# EAGLE design Main (EAGLE 7.2.0)
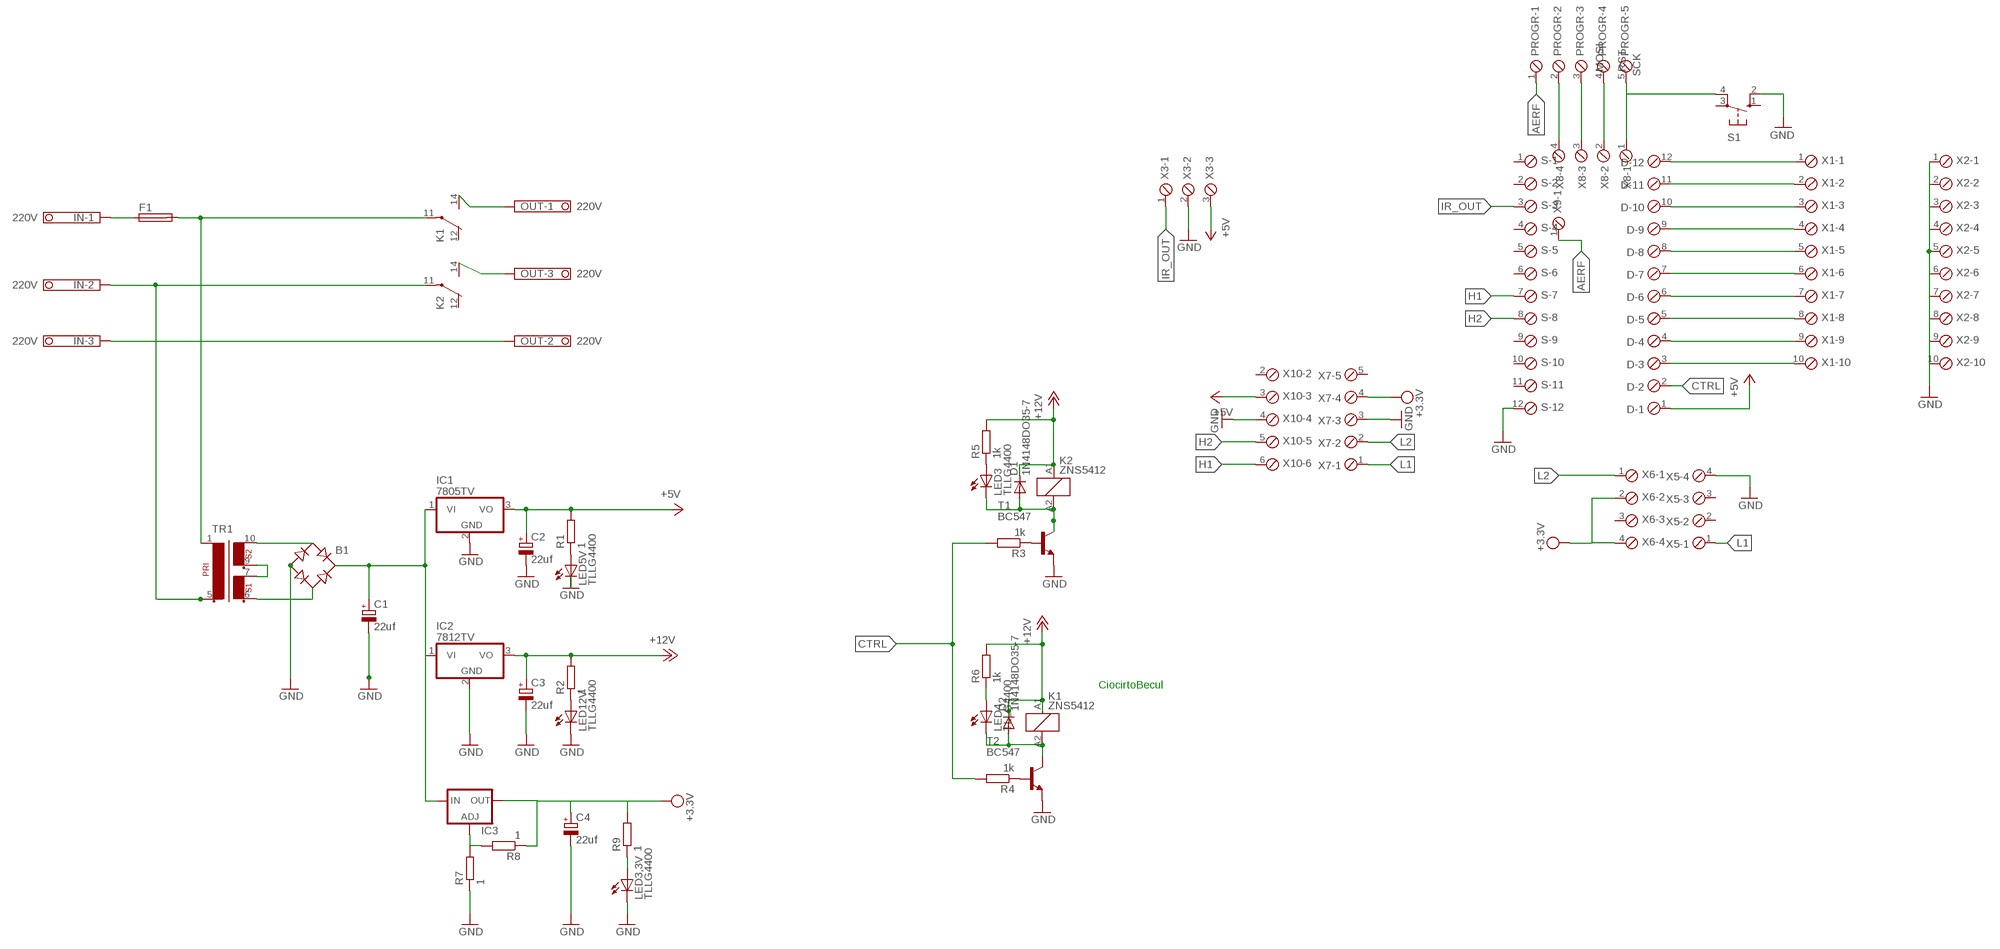
[diagram p0: schematic, sheet 1]

## Parts
B1  RB1A  [RB1A]
C1  22uf  CPOL-EUE2-4  [E2-4]
C2  22uf  CPOL-EUE2-4  [E2-4]
C3  22uf  CPOL-EUE2-4  [E2-4]
C4  22uf  CPOL-EUE2-4  [E2-4]
D  MPT12  [12POL254]
D1  1N4148DO35-7  [DO35-7]
D2  1N4148DO35-7  [DO35-7]
F1  SH25  [SH25]
IC1  7805TV  [TO220V]
IC2  7812TV  [TO220V]
IC3  LM317TS  [317TS]
IN  220V  1751251  [1751251]
K1  ZNS5412  [ZN5]
K2  ZNS5412  [ZN5]
LED3  TLLG4400  [LED3MM]
LED3,3V  TLLG4400  [LED3MM]
LED4  TLLG4400  [LED3MM]
LED5V  TLLG4400  [LED3MM]
LED12V  TLLG4400  [LED3MM]
OUT  220V  1751251  [1751251]
PROGR  SCK  MPT5  [5POL254]
R1  1  R-EU_0204/5  [0204/5]
R2  1  R-EU_0204/5  [0204/5]
R3  1k  R-EU_0204/5  [0204/5]
R4  1k  R-EU_0204/5  [0204/5]
R5  1k  R-EU_0204/5  [0204/5]
R6  1k  R-EU_0204/5  [0204/5]
R7  1  R-EU_0204/5  [0204/5]
R8  1  R-EU_0204/5  [0204/5]
R9  1  R-EU_0204/5  [0204/5]
S  MPT12  [12POL254]
S1  10-XX  [B3F-10XX]
T1  BC547  [TO92]
T2  BC547  [TO92]
TR1  EI30-2  [EI30-2]
X1  MPT10  [10POL254]
X2  MPT10  [10POL254]
X3  MPT3  [3POL254]
X5  MPT4  [4POL254]
X6  MPT4  [4POL254]
X7  MPT6  [6POL254]
X8  MPT4  [4POL254]
X9  MPT2  [2POL254]
X10  MPT6  [6POL254]

## Nets
+5V: C2.+ D.1 IC1.3(VO) R1.2 X3.3 X10.3
+12V: C3.+ D1.C D2.C IC2.3(VO) K1.A1 K2.A1 R2.2 R5.2 R6.2
AERF: PROGR.1 X9.1
CTRL: D.2 R3.2 R4.2
GND: B1.- C1.- C2.- C3.- C4.- IC1.2(GND) IC2.2(GND) LED3,3V.K(C) LED5V.K(C) LED12V.K(C) R7.1 S1.2(S1) S.12 T1.1(E) T2.1(E) X2.1 X2.2 X2.3 X2.4 X2.5 X2.6 X2.7 X2.8 X2.9 X2.10 X3.2 X5.4 X7.3 X10.4
H1: S.7 X10.6
H2: S.8 X10.5
IR_OUT: S.3 X3.1
L1: X5.1 X7.1
L2: X6.1 X7.2
N$1: F1.2 K1.11(2:P) TR1.1
N$2: IN.2 K2.11(2:P) TR1.5
N$3: F1.1 IN.1
N$4: K2.14(2:S) OUT.3
N$5: TR1.7 TR1.9
N$6: B1.AC1 TR1.10
N$7: B1.AC2 TR1.6
N$8: B1.+ C1.+ IC1.1(VI) IC2.1(VI) IC3.3(IN)
N$9: D1.A K2.A2 LED3.K(C) T1.3(C)
N$10: LED12V.A R2.1
N$11: LED3.A R5.1
N$12: D2.A K1.A2 LED4.K(C) T2.3(C)
N$13: LED5V.A R1.1
N$14: R3.1 T1.2(B)
N$15: R4.1 T2.2(B)
N$16: PROGR.2 X8.4
N$17: IN.3 OUT.2
N$18: LED4.A R6.1
N$19: IC3.1(ADJ) R7.2 R8.2
N$20: LED3,3V.A R9.1
N$23: PROGR.3 X8.3
N$24: PROGR.4 X8.2
N$25: PROGR.5 S1.4(P1) X8.1
N$27: K1.14(2:S) OUT.1
N$41: D.12 X1.1
N$42: D.11 X1.2
N$43: D.10 X1.3
N$44: D.9 X1.4
N$45: D.8 X1.5
N$46: D.7 X1.6
N$47: D.6 X1.7
N$48: D.5 X1.8
N$49: D.4 X1.9
N$50: D.3 X1.10
VCC: C4.+ IC3.2(OUT) R8.1 R9.2 X6.2 X6.4 X7.4 ; supply symbol labelled +3.3V
Unconnected: K1.12(2:O) K2.12(2:O) S1.1(S) S1.3(P) S.1 S.2 S.4 S.5 S.6 S.9 S.10 S.11 X5.2 X5.3 X6.3 X7.5 X7.6 X9.2 X10.1 X10.2

## Notes on the sheet
- CiocirtoBecul

## Library data of the parts
B1 = rectifier:RB1A: RECTIFIER 1 A
C1-C4 = rcl:CPOL-EU: POLARIZED CAPACITOR, European symbol
D S = con-phoenix-254:MPT12: PHOENIX CONNECTOR; OC_FARNELL: unknown; OC_NEWARK: unknown
D1 D2 = diode:1N4148: DIODE high speed (Philips)
F1 = fuse:SH25: FUSE HOLDER grid 25 mm, OGN0031 8211, Schurter (Buerklin); MF: SCHURTER; MPN: 0031.8211; OC_FARNELL: 1162741; OC_NEWARK: 96B9380
IC1 IC2 = linear:78*: Positive VOLTAGE REGULATOR Source: http://cache.national.com/ds/LM/LM78L05.pdf http://www.fairchildsemi.com/ds/LM/LM7805.pdf
IC3 = v-reg:LM317TS: VOLTAGE REGULATOR
IN OUT = con-phoenix-350:1751251: MKDS 1/ 3-3,5 Printklemme Nennstrom: 10 A Bemessungsspannung: 160 V Raster: 3,5 mm Polzahl: 3 Montageart: Löten Anschlussart: Schraubanschluss Anschlussrichtung vom Leiter zur Platine: 0° Source: http://eshop.phoenixcontact.com .. 1751251.pdf; OC_FARNELL: unknown; OC_NEWARK: unknown
K1 K2 = relay:ZNS5*: Miniature Power PCB Relay SCHRACK 1pole 10 A Source: http://www.schrack.com/.. 5847.pdf; OC_FARNELL: unknown; OC_NEWARK: unknown
LED3 LED3,3V LED4 LED5V LED12V = led:TLLG4400: Low Current (2mA) LED 3 mm Tinted Diffused Package color GREEN Source: Data sheet <http://www.farnell.com/datasheets/391098.pdf>; MF: VISHAY SEMICONDUCTOR; OC_FARNELL: 1612435
PROGR = con-phoenix-254:MPT5: PHOENIX CONNECTOR; KIND: RST; KIND2: MOSI; OC_FARNELL: unknown; OC_NEWARK: unknown
R1-R9 = rcl:R-EU_: RESISTOR, European symbol
S1 = switch-omron:10-XX: OMRON SWITCH; MPN: B3F-1000; OC_FARNELL: 176432; OC_NEWARK: 36M3542
T1 T2 = transistor:BC547: NPN TRANSISTOR
TR1 = trafo:EI30-2: TRANSFORMER 1 primary winding, 2 secondary windings ERA
X1 X2 = con-phoenix-254:MPT10: PHOENIX CONNECTOR; OC_FARNELL: unknown; OC_NEWARK: unknown
X3 = con-phoenix-254:MPT3: PHOENIX CONNECTOR; OC_FARNELL: unknown; OC_NEWARK: unknown
X5 X6 X8 = con-phoenix-254:MPT4: PHOENIX CONNECTOR; OC_FARNELL: unknown; OC_NEWARK: unknown
X7 X10 = con-phoenix-254:MPT6: PHOENIX CONNECTOR; OC_FARNELL: unknown; OC_NEWARK: unknown
X9 = con-phoenix-254:MPT2: PHOENIX CONNECTOR; OC_FARNELL: unknown; OC_NEWARK: unknown

## Net classes
0 default: width 0.61 mm

## Board
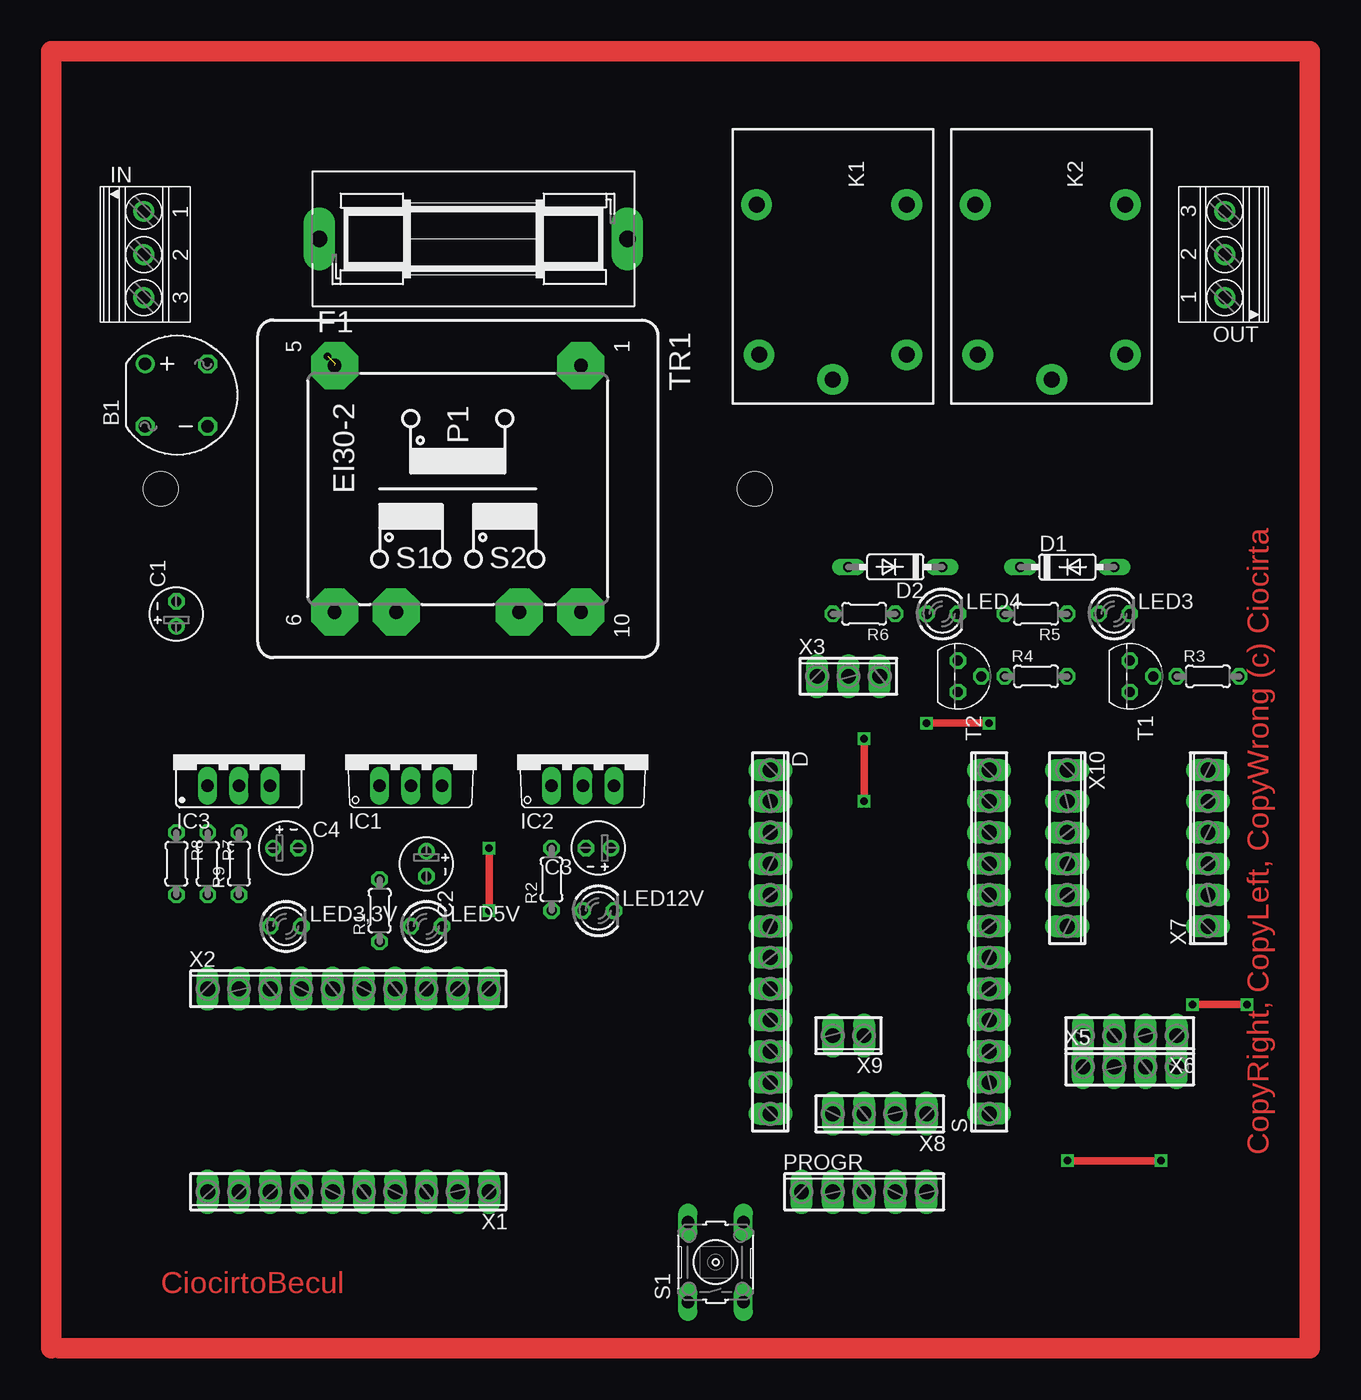
[diagram p1: board, top side]
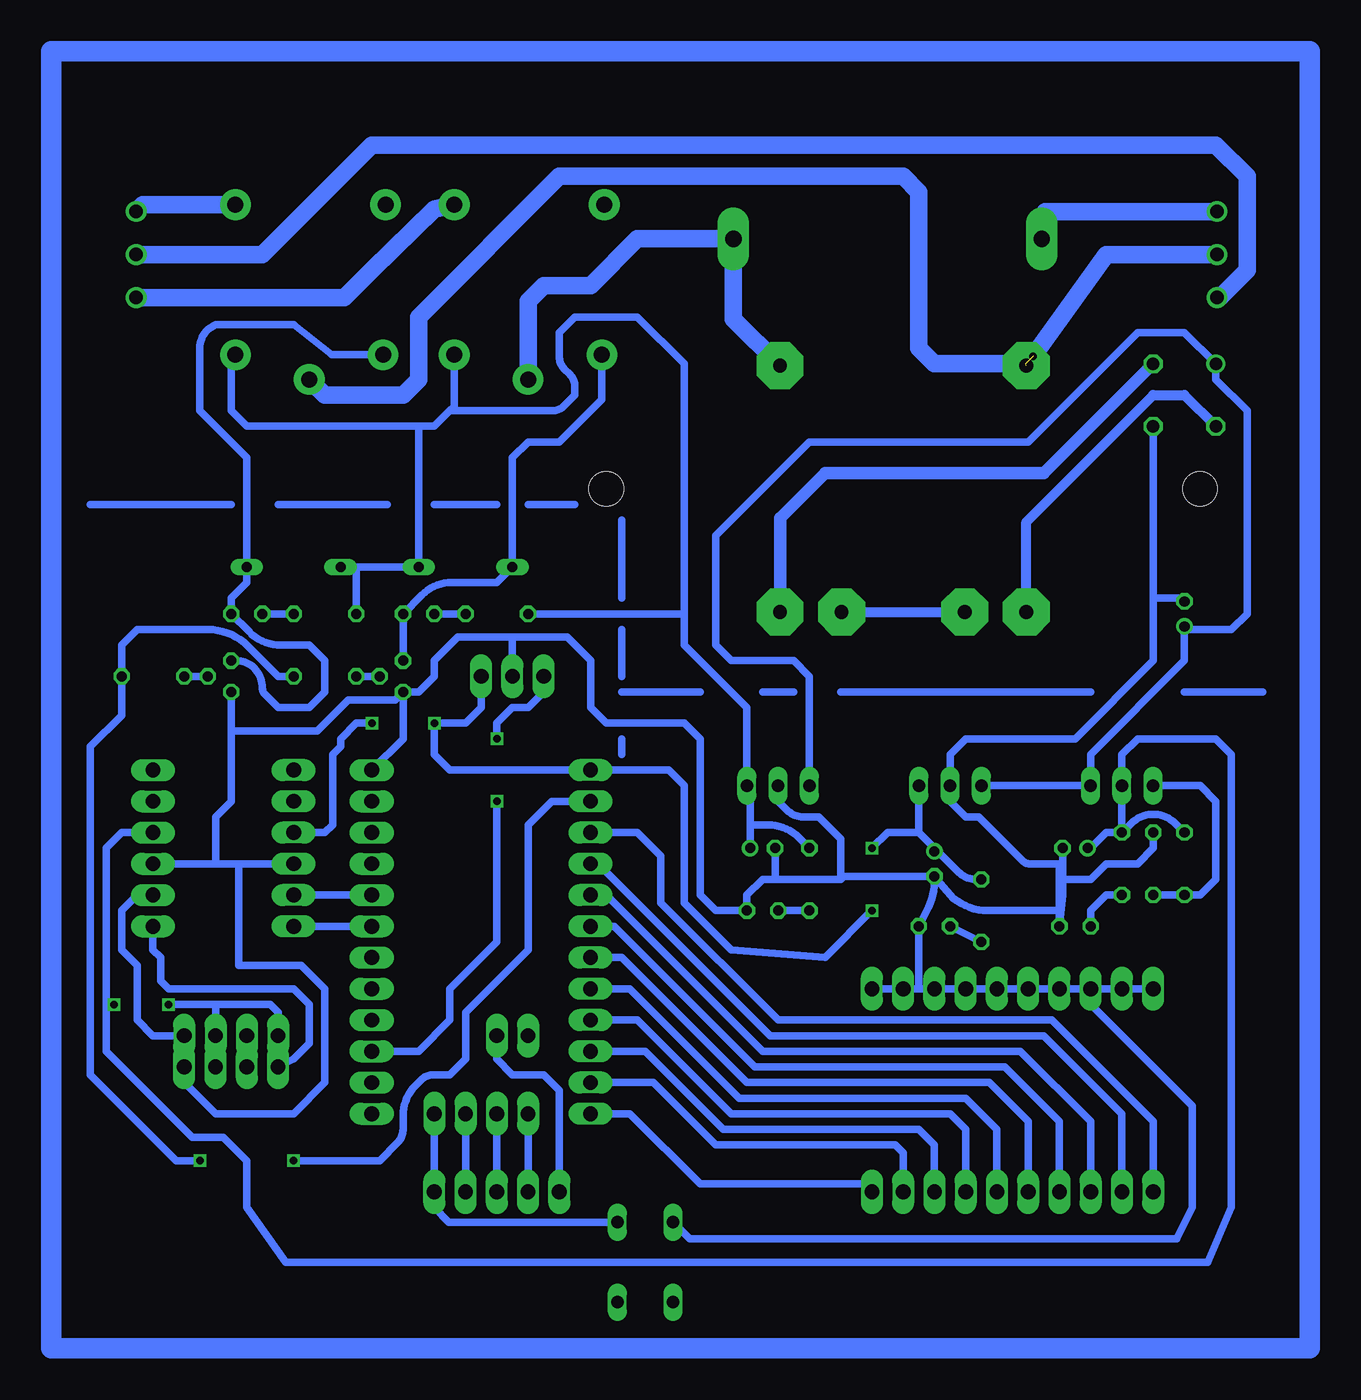
[diagram p2: board, bottom side, seen from below]

No outline drawn. Coordinates in mm, seen from the top.
Copper layers (1*16): Top 0.035mm / dielectric 1.5mm / Bottom 0.035mm
Design rules "default": minimum track width 10mil, minimum drill 24mil, track to track 8mil, track to pad 8mil, pad to pad 8mil, via to via 8mil, smd to smd 8mil, copper to edge 40mil, drill to drill 8mil, minimum pad ring 10mil, minimum via ring 8mil, stop-mask expansion 4mil, vias tented up to drill 0mil, thermal gap 10mil
Holes 2.8 mm at -11.43,48.26 36.83,48.26

### Footprints (pad centres in the part's own frame; a part is rotated, then mirrored left to right if it is on the bottom)
RB1A = drill 1.016: + -2.54,2.54 | drill 1.016 octagon: - 2.54,-2.54; AC1 2.54,2.54; AC2 -2.54,-2.54
E2-4 = drill 0.813 pad 1.27: + -1.016,0 | drill 0.813 pad 1.27 octagon: - 1.016,0
12POL254 = drill 1.2 long: 1 -13.97,0; 2 -11.43,0; 3 -8.89,0; 4 -6.35,0; 5 -3.81,0; 6 -1.27,0; 7 1.27,0; 8 3.81,0; 9 6.35,0; 10 8.89,0; 11 11.43,0; 12 13.97,0
DO35-7 = drill 0.813 long: A 3.81,0; C -3.81,0
SH25 = drill 1.321 pad 2.54 long: 1 -12.522,0; 2 12.522,0
TO220V = drill 1.016 long: 1 -2.54,-2.54; 2 0,-2.54; 3 2.54,-2.54
317TS = drill 1.016 long: 1 -2.54,-2.54; 2 0,-2.54; 3 2.54,-2.54
1751251 = drill 1.1 pad 1.7: 1 -3.5,-0.1; 2 0,-0.1; 3 3.5,-0.1
ZN5 = drill 1.3 pad 2.5: 11 8.89,0; 12 -5.31,-6.2; 14 -5.31,6; A1 6.89,6; A2 6.89,-6
LED3MM = drill 0.813 octagon: A -1.27,0; K 1.27,0
5POL254 = drill 1.2 long: 1 -5.08,0; 2 -2.54,0; 3 0,0; 4 2.54,0; 5 5.08,0
0204/5 = drill 0.813 octagon: 1 -2.54,0; 2 2.54,0
B3F-10XX = drill 1.016 long: 1 -3.251,2.261; 2 3.251,2.261; 3 -3.251,-2.261; 4 3.251,-2.261
TO92 = drill 0.813 octagon: 1 1.27,0; 2 0,1.905; 3 -1.27,0
EI30-2 = drill 1.118 pad 3.81 octagon: 1 -10.008,10.008; 5 -10.008,-10.008; 6 10.008,-10.008; 7 10.008,-5.004; 9 10.008,5.004; 10 10.008,10.008
10POL254 = drill 1.2 long: 1 -11.43,0; 2 -8.89,0; 3 -6.35,0; 4 -3.81,0; 5 -1.27,0; 6 1.27,0; 7 3.81,0; 8 6.35,0; 9 8.89,0; 10 11.43,0
3POL254 = drill 1.2 long: 1 -2.54,0; 2 0,0; 3 2.54,0
4POL254 = drill 1.2 long: 1 -3.81,0; 2 -1.27,0; 3 1.27,0; 4 3.81,0
6POL254 = drill 1.2 pad 1.778 long: 1 -6.35,0; 2 -3.81,0; 3 -1.27,0; 4 1.27,0; 5 3.81,0; 6 6.35,0
2POL254 = drill 1.2 long: 1 -1.27,0; 2 1.27,0

### Placement (x,y rotation side)
B1  -10.16,55.88 0 top
C1  -10.16,38.1 90 top
C2  10.16,17.78 270 top
C3  24.13,19.05 180 top
C4  -1.27,19.05 0 top
D  38.1,11.43 270 top
D1  62.23,41.91 0 top
D2  48.26,41.91 180 top
F1  13.97,68.58 0 top
IC1  8.89,26.67 0 top
IC2  22.86,26.67 0 top
IC3  -5.08,26.67 0 top
IN  -12.7,67.31 270 top
K1  43.18,66.04 270 top
K2  60.96,66.04 270 top
LED3  66.04,38.1 0 top
LED3,3V  -1.27,12.7 0 top
LED4  52.07,38.1 0 top
LED5V  10.16,12.7 0 top
LED12V  24.13,13.97 0 top
OUT  74.93,67.31 90 top
PROGR  45.72,-8.89 0 top
R1  6.35,13.97 90 top
R2  20.32,16.51 90 top
R3  73.66,33.02 0 top
R4  59.69,33.02 0 top
R5  59.69,38.1 180 top
R6  45.72,38.1 180 top
R7  -7.62,17.78 270 top
R8  -10.16,17.78 270 top
R9  -5.08,17.78 90 top
S  55.88,11.43 90 top
S1  33.66,-14.61 90 top
T1  67.31,33.02 270 top
T2  53.34,33.02 270 top
TR1  12.7,48.26 270 top
X1  3.81,-8.89 180 top
X2  3.81,7.62 0 top
X3  44.45,33.02 0 top
X5  67.31,1.27 0 top
X6  67.31,3.81 180 top
X7  73.66,19.05 90 top
X8  46.99,-2.54 180 top
X9  44.45,3.81 180 top
X10  62.23,19.05 270 top

### Tracks (layer width: path | path; a pad name or v marks a point on that pad's centre or on a via)
+5V  (via drill 0.61)
  Top 0.61: v50.8,29.21 v55.88,29.21 | v15.24,13.97 v15.24,19.05
  Bottom 0.61: 11.43,20.32 10.16,19.05 C2.+ 9.91,18.8 8.21,17.1 arc-45 6.79,16.51 R1.2 | 11.43,20.32 IC1.3 | X3.3 46.99,30.48 48.26,29.21 v50.8,29.21 50.8,26.67 49.53,25.4 D.1 31.75,25.4 30.48,24.13 30.48,14.61 26.67,10.79 19.05,10.16 v15.24,13.97 | v15.24,19.05 13.97,20.32 11.43,20.32 | v55.88,29.21 57.15,29.21 58.42,27.94 58.42,27.3 59.05,26.67 59.05,20.95 59.69,20.32 X10.3
+12V
  Bottom 0.61: 25.15,20.95 25.15,24.13 IC2.3 25.4,30.48 30.48,35.56 30.48,38.1 | 25.15,20.95 C3.+ | R2.2 21.17,19.9 arc-45 23.71,20.95 25.15,20.95 | K1.A1 49.18,54.96 49.53,54.61 | 49.53,54.61 50.8,53.34 52.07,53.34 | 52.07,53.34 66.04,53.34 67.31,54.61 67.31,58.8 K2.A1 | 49.53,54.61 41.23,54.61 arc-45 40.22,55.03 39.37,55.88 39.37,56.56 arc-45 39.79,57.57 40.22,58 arc45 40.64,59.01 40.64,60.96 39.37,62.23 34.29,62.23 30.48,58.42 30.48,38.1 | 52.07,53.34 D2.C 57.15,41.91 | R6.2 30.48,38.1 | D1.C 57.15,41.91 | 57.15,41.91 R5.2
AERF
  Bottom 0.61: 40.64,-10.16 PROGR.1 40.64,-0.64 41.91,0.64 44.45,0.64 45.72,1.91 X9.1
CTRL  (via drill 0.61)
  Top 0.61: v62.23,-6.35 v69.85,-6.35
  Bottom 0.61: R4.2 63.5,33.02 65.97,35.49 arc-45 69.21,36.83 74.93,36.83 76.2,35.56 R3.2 76.2,29.84 78.74,27.3 78.74,0.64 71.75,-6.35 v69.85,-6.35 | D.2 41.27,22.86 43.18,20.95 43.18,10.79 48.26,5.71 48.26,1.91 49.53,0.64 50.85,0.64 arc-45 51.85,0.22 52.34,-0.27 arc-45 53.34,-2.69 53.34,-3.86 arc45 53.76,-4.86 55.24,-6.35 v62.23,-6.35
GND
  Bottom 0.61: 22.86,19.05 C3.- 23.11,16.51 | 23.11,16.51 24.13,16.51 25.4,15.24 LED12V.K 27.94,13.97 29.21,15.24 29.21,27.94 30.48,29.21 36.83,29.21 38.1,30.48 38.1,34.29 40.01,36.2 44.45,36.2 | IC2.2 22.86,22.86 22.15,22.15 arc-45 20.8,21.59 19.58,21.59 17.78,19.79 17.78,16.51 | 17.78,16.51 23.11,16.51 | R7.1 -7.62,19.05 -6.35,17.78 -3.81,17.78 -2.54,16.51 -0.25,16.51 | 0,19.05 C4.- -0.25,16.51 | -0.25,16.51 -0.25,15.24 LED3,3V.K 0,13.97 | 0,13.97 0,17.78 2.44,17.78 arc45 2.98,18 6.57,21.59 7.62,21.59 8.89,22.86 IC1.2 8.89,26.67 7.62,27.94 -1.27,27.94 -7.62,34.29 -7.62,39.37 | B1.- -7.62,39.37 | -9.91,39.12 C1.- -9.91,39.37 -7.62,39.37 | C2.- 17.53,16.76 17.78,16.51 | C2.- 10.16,16.3 arc27 10.63,14.29 LED5V.K 11.43,7.62 | C2.- 8.89,15.24 arc-45 5.82,13.97 0,13.97 | T2.1 52.07,31.75 50.8,33.02 50.8,34.29 48.9,36.2 44.45,36.2 | T2.1 53.34,27.94 S.12 | X2.3 -2.54,6.35 -10.79,-1.91 -10.79,-10.16 -9.53,-12.7 30.05,-12.7 S1.2 | X2.1 X2.2 X2.3 | X2.3 -1.27,7.62 | 0.64,7.62 X2.4 | X2.3 X2.4 | X2.8 X2.7 X2.6 X2.5 X2.4 | X2.8 10.79,7.62 10.79,6.99 | X2.8 11.43,7.62 | 11.43,7.62 X2.9 X2.10 | X3.2 44.45,36.2 | X7.3 68.58,17.78 | T1.1 67.31,28.57 | X10.4 66.67,17.78 | 66.67,17.78 68.58,17.78 | 68.58,17.78 68.58,21.59 67.31,22.86 67.31,28.57 | 67.31,28.57 60.33,28.57 57.78,31.11 53.98,31.11 T2.1 | X5.4 71.12,0 68.58,-2.54 62.23,-2.54 59.69,0 59.69,7.62 61.59,9.53 66.67,9.53 66.67,17.78
H1
  Bottom 0.61: S.7 X10.6
H2
  Bottom 0.61: S.8 X10.5
IR_OUT  (via drill 0.61)
  Top 0.61: v45.72,27.94 v45.72,22.86
  Bottom 0.61: X3.1 41.91,31.75 43.18,30.48 44.45,30.48 45.72,29.21 v45.72,27.94 | v45.72,22.86 45.72,11.43 49.53,7.62 49.53,5.08 52.07,2.54 S.3
L1
  Bottom 0.61: X7.1 73.66,10.79 73.03,10.16 73.03,8.26 72.39,7.62 62.23,7.62 60.96,6.35 60.96,3.17 62.23,1.91 X5.1
L2
  Bottom 0.61: X7.2 74.93,15.24 76.2,13.97 76.2,10.79 74.93,9.53 74.93,5.08 73.66,3.81 X6.1
N$1
  Bottom 1.422: TR1.1 26.49,62.05 F1.2 34.29,68.58 38.1,64.77 41.91,64.77 43.18,63.5 K1.11
N$2  (via drill 0.61)  (2 unrouted)
  Bottom 1.422: IN.2 -3.81,67.31 v2.13,59.04 | v2.76,58.42 10.16,58.42 11.43,59.69 11.43,72.39 12.7,73.66 40.64,73.66 52.07,62.23 52.07,57.15 53.34,55.88 59.69,55.88 K2.11
N$3
  Bottom 1.422: IN.1 1.14,70.81 F1.1
N$4
  Bottom 1.422: K2.14 74.49,71.35 OUT.3
N$5
  Bottom 0.813: TR1.9 TR1.7
N$6
  Bottom 1.016: TR1.10 22.71,45.87 19.05,49.53 1.27,49.53 B1.AC1
N$7
  Bottom 0.813: TR1.6 2.69,45.57 -7.62,55.88 -10.16,55.88 B1.AC2
N$8
  Bottom 0.61: IC1.1 IC3.3 -2.54,26.67 -10.16,34.29 C1.+ -10.41,36.83 -13.97,36.83 -15.24,38.1 -15.24,54.61 -12.7,57.15 B1.+ -10.16,60.96 -6.35,60.96 2.54,52.07 20.32,52.07 27.94,44.45 27.94,35.56 26.67,34.29 21.59,34.29 20.32,33.02 IC2.1
N$9
  Bottom 0.61: K2.A2 59.15,59.15 62.23,61.59 68.58,61.59 68.74,61.52 arc-63 69.85,59.72 69.85,54.61 66.04,50.8 D1.A 66.04,40.64 67.31,39.37 LED3.K 65.85,36.64 arc-45 63.24,35.56 60.96,35.56 59.69,34.29 59.69,31.75 60.96,30.48 63.5,30.48 64.54,31.52 arc45 64.77,32.07 arc-45 65.44,33.69 arc-45 66.89,34.29 T1.3
N$10
  Bottom 0.61: LED12V.A R2.1
N$11
  Bottom 0.61: R5.1 LED3.A
N$12
  Bottom 0.61: K1.A2 37.18,55.53 40.64,52.07 43.18,52.07 44.45,50.8 D2.A 45.72,40.64 49.38,40.64 arc-45 51.8,39.64 LED4.K T2.3
N$13
  Bottom 0.61: R1.1 LED5V.A
N$14
  Bottom 0.61: R3.1 T1.2
N$15
  Bottom 0.61: T2.2 R4.1
N$16
  Bottom 0.61: X8.4 PROGR.2
N$17
  Bottom 1.422: IN.3 -13.01,63.81 -15.24,66.04 -15.24,73.66 -12.7,76.2 55.88,76.2 64.77,67.31 OUT.2
N$18
  Bottom 0.61: R6.1 LED4.A
N$19
  Bottom 0.61: IC3.1 -11.43,24.13 -12.7,22.86 -12.7,16.51 -11.43,15.24 R8.2 R7.2
N$20
  Bottom 0.61: LED3,3V.A -2.54,13.97 -3.81,15.24 R9.1
N$22
  Bottom 0.61: -16.51,31.75 -10.16,31.75
N$23
  Bottom 0.61: PROGR.3 X8.3
N$24
  Bottom 0.61: PROGR.4 X8.2
N$25
  Bottom 0.61: S1.4 49.61,-11.35 50.8,-10.16 50.8,-9.53 PROGR.5 X8.1
N$27
  Bottom 1.422: OUT.1 58.11,63.81 55.88,66.04 50.8,71 K1.14
N$28
  Bottom 0.61: -2.54,31.75 17.78,31.75
N$29
  Bottom 0.61: 21.59,31.75 24.13,31.75
N$30
  Bottom 0.61: 29.21,31.75 35.56,31.75
N$31
  Bottom 0.61: 54.61,46.99 63.5,46.99
N$32
  Bottom 0.61: 67.31,46.99 78.74,46.99
N$33
  Bottom 0.61: 50.8,46.99 45.72,46.99
N$34
  Bottom 0.61: 39.37,46.99 43.18,46.99
N$35
  Bottom 0.61: 35.56,45.72 35.56,39.37
N$36
  Bottom 0.61: 35.56,36.83 35.56,33.02
N$37
  Bottom 0.61: 35.56,27.94 35.56,26.67
N$39
  Bottom 1.676: 81.92,-21.59 81.92,83.82 -20.32,83.82 -20.32,-21.59 81.92,-21.59
N$40
  Top 1.676: -19.68,-21.59 81.92,-21.59 81.92,83.82 -20.32,83.82 -20.32,-21.59
N$41
  Bottom 0.61: D.12 35.56,-2.54 34.92,-2.54 29.21,-8.26 15.88,-8.26 X1.1
N$42
  Bottom 0.61: X1.2 12.7,-5.71 13.34,-5.08 27.94,-5.08 33.02,0 D.11
N$43
  Bottom 0.61: X1.3 10.16,-5.08 11.43,-3.81 27.3,-3.81 33.66,2.54 D.10
N$44
  Bottom 0.61: X1.4 7.62,-3.81 8.89,-2.54 26.67,-2.54 34.29,5.08 D.9
N$45
  Bottom 0.61: X1.5 5.08,-3.81 7.62,-1.27 26.04,-1.27 34.92,7.62 D.8
N$46
  Bottom 0.61: X1.6 2.54,-3.17 5.71,0 25.4,0 35.56,10.16 D.7
N$47
  Bottom 0.61: X1.7 0,-3.17 4.45,1.27 24.77,1.27 36.2,12.7 D.6
N$48
  Bottom 0.61: 38.73,15.24 D.5 36.83,15.24 24.13,2.54 3.17,2.54 -2.54,-3.17 X1.8
N$49
  Bottom 0.61: D.4 37.47,17.78 23.5,3.81 1.27,3.81 -5.08,-2.54 X1.9
N$50
  Bottom 0.61: D.3 34.29,20.32 32.38,18.41 32.38,14.61 22.86,5.08 0.64,5.08 -7.62,-3.17 X1.10
VCC  (via drill 0.61)
  Top 0.61: v76.83,6.35 v72.39,6.35
  Bottom 0.61: R9.2 -3.81,20.32 -2.54,19.05 C4.+ | R9.2 -5.82,21.06 arc90 -9.42,21.06 R8.1 | R9.2 IC3.2 -5.08,26.67 -6.35,27.94 -12.7,27.94 -13.97,26.67 -13.97,-10.16 -12.06,-14.61 62.87,-14.61 66.04,-10.16 66.04,-6.35 67.94,-4.45 70.48,-4.45 77.47,2.54 77.47,6.35 | 77.47,6.35 77.47,19.05 76.2,20.32 X7.4 | X6.4 63.5,5.71 64.14,6.35 68.58,6.35 | 68.58,6.35 X6.2 | 77.47,6.35 v76.83,6.35 | v72.39,6.35 68.58,6.35

### Text on the board
Top: CopyRight, CopyLeft, CopyWrong (c) Ciocirta | CiocirtoBecul